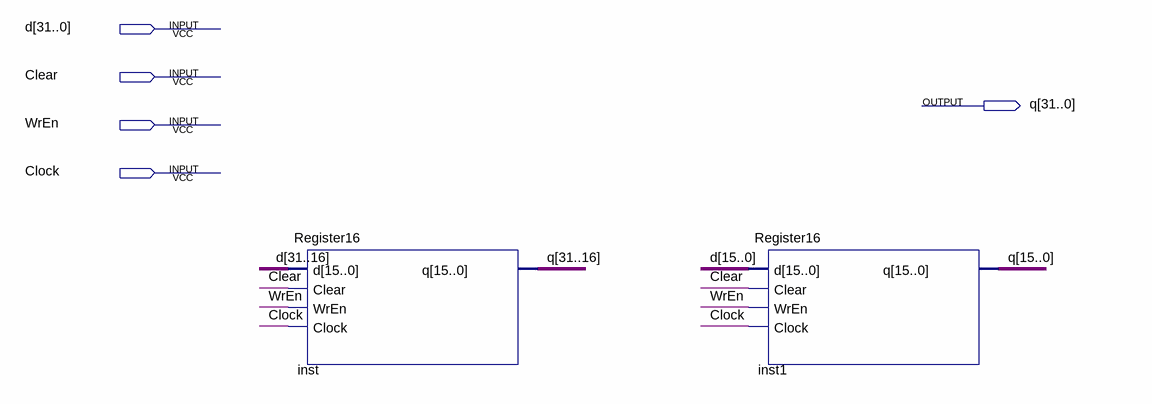
[diagram p0: schematic sheet]
// Quartus schematic Register32.bdf as structural Verilog: 2 symbols, 5 pins
module Register32 (
  input  [31:0] d,
  input  Clear,
  input  WrEn,
  input  Clock,
  output [31:0] q
);

  Register16 inst (.d(d[31:16]), .Clear(Clear), .WrEn(WrEn), .Clock(Clock), .q(q[31:16]));
  Register16 inst1 (.d(d[15:0]), .Clear(Clear), .WrEn(WrEn), .Clock(Clock), .q(q[15:0]));
endmodule
